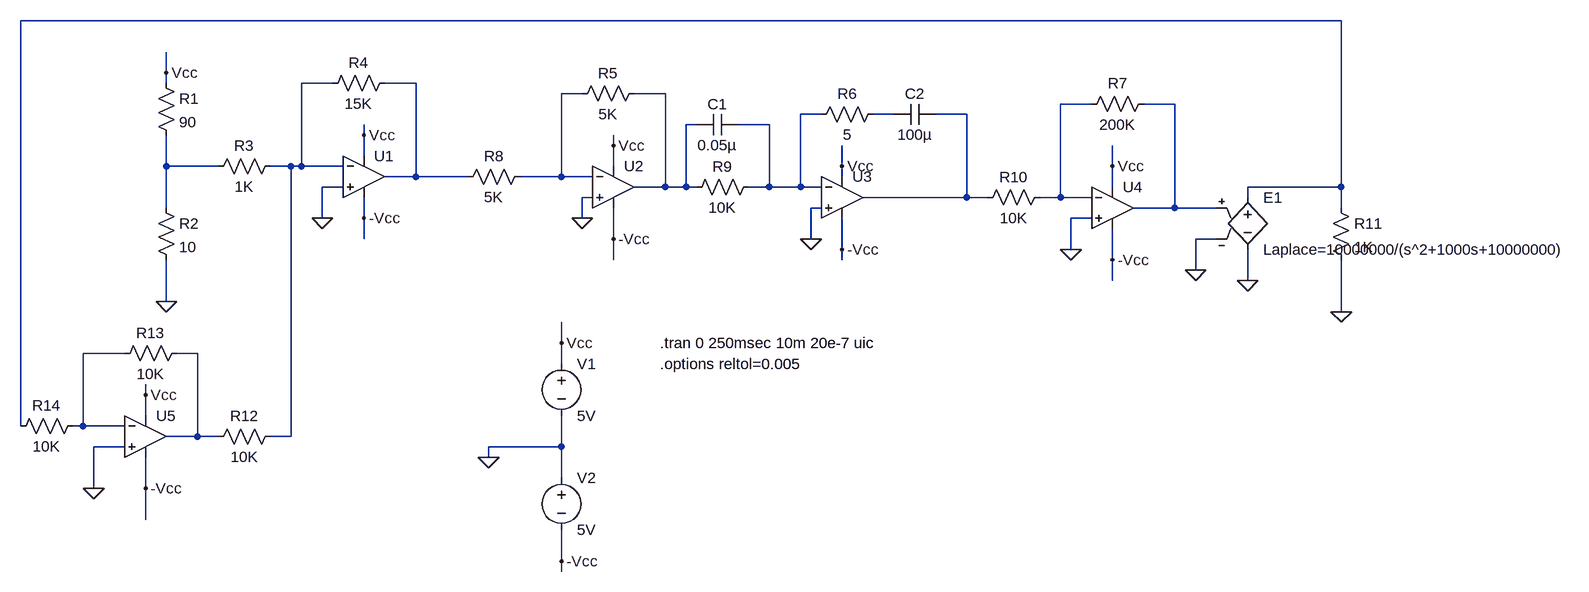
[diagram p0: schematic Practica_5.asc]
Practica_5.asc, the LTspice schematic file:
Version 4
SHEET 1 2892 772
WIRE 2480 -128 448 -128
WIRE 672 -48 672 -80
WIRE 672 -32 672 -48
WIRE 928 -32 880 -32
WIRE 1056 -32 1008 -32
WIRE 1312 -16 1280 -16
WIRE 1440 -16 1392 -16
WIRE 2096 0 2048 0
WIRE 2224 0 2176 0
WIRE 1680 16 1648 16
WIRE 1792 16 1760 16
WIRE 1904 16 1856 16
WIRE 1488 32 1472 32
WIRE 1600 32 1552 32
WIRE 976 48 976 32
WIRE 1360 64 1360 48
WIRE 976 80 976 48
WIRE 672 96 672 48
WIRE 752 96 672 96
WIRE 864 96 832 96
WIRE 880 96 880 -32
WIRE 880 96 864 96
WIRE 944 96 880 96
WIRE 1360 96 1360 64
WIRE 1712 96 1712 64
WIRE 2128 96 2128 64
WIRE 1056 112 1056 -32
WIRE 1056 112 1008 112
WIRE 1136 112 1056 112
WIRE 1280 112 1280 -16
WIRE 1280 112 1216 112
WIRE 1328 112 1280 112
WIRE 1712 112 1712 96
WIRE 944 128 912 128
WIRE 1440 128 1440 -16
WIRE 1440 128 1392 128
WIRE 1472 128 1472 32
WIRE 1472 128 1440 128
WIRE 1488 128 1472 128
WIRE 1600 128 1600 32
WIRE 1600 128 1568 128
WIRE 1648 128 1648 16
WIRE 1648 128 1600 128
WIRE 1680 128 1648 128
WIRE 2128 128 2128 96
WIRE 2480 128 2480 -128
WIRE 2480 128 2336 128
WIRE 1328 144 1312 144
WIRE 1904 144 1904 16
WIRE 1904 144 1744 144
WIRE 1936 144 1904 144
WIRE 2048 144 2048 0
WIRE 2048 144 2016 144
WIRE 2096 144 2048 144
WIRE 2336 144 2336 128
WIRE 672 160 672 96
WIRE 1680 160 1664 160
WIRE 2224 160 2224 0
WIRE 2224 160 2160 160
WIRE 2288 160 2224 160
WIRE 2480 160 2480 128
WIRE 912 176 912 128
WIRE 976 176 976 144
WIRE 1312 176 1312 144
WIRE 2096 176 2064 176
WIRE 976 208 976 176
WIRE 1360 208 1360 160
WIRE 1664 208 1664 160
WIRE 2288 208 2256 208
WIRE 1712 224 1712 176
WIRE 2064 224 2064 176
WIRE 1360 240 1360 208
WIRE 1712 240 1712 224
WIRE 2128 240 2128 192
WIRE 2256 256 2256 208
WIRE 2128 272 2128 240
WIRE 2336 272 2336 224
WIRE 672 304 672 240
WIRE 2480 320 2480 240
WIRE 1280 368 1280 336
WIRE 608 384 544 384
WIRE 720 384 688 384
WIRE 1280 400 1280 368
WIRE 640 448 640 432
WIRE 640 480 640 448
WIRE 448 496 448 -128
WIRE 544 496 544 384
WIRE 544 496 528 496
WIRE 608 496 544 496
WIRE 720 512 720 384
WIRE 720 512 672 512
WIRE 752 512 720 512
WIRE 864 512 864 96
WIRE 864 512 832 512
WIRE 608 528 560 528
WIRE 1280 528 1280 480
WIRE 1280 528 1168 528
WIRE 1168 544 1168 528
WIRE 1280 576 1280 528
WIRE 560 592 560 528
WIRE 640 592 640 544
WIRE 640 640 640 592
WIRE 1280 704 1280 656
WIRE 1280 720 1280 704
FLAG 1168 544 0
FLAG 1280 368 Vcc
FLAG 1280 704 -Vcc
FLAG 672 304 0
FLAG 672 -48 Vcc
FLAG 976 48 Vcc
FLAG 976 176 -Vcc
FLAG 1360 64 Vcc
FLAG 1360 208 -Vcc
FLAG 912 176 0
FLAG 1312 176 0
FLAG 1712 96 Vcc
FLAG 1712 224 -Vcc
FLAG 1664 208 0
FLAG 2128 96 Vcc
FLAG 2128 240 -Vcc
FLAG 640 448 Vcc
FLAG 640 592 -Vcc
FLAG 560 592 0
FLAG 2480 320 0
FLAG 2064 224 0
FLAG 2256 256 0
FLAG 2336 272 0
SYMBOL voltage 1280 384 R0
WINDOW 123 0 0 Left 0
WINDOW 39 0 0 Left 0
SYMATTR InstName V1
SYMATTR Value 5V
SYMBOL voltage 1280 560 R0
WINDOW 123 0 0 Left 0
WINDOW 39 0 0 Left 0
SYMATTR InstName V2
SYMATTR Value 5V
SYMBOL res 656 -48 R0
SYMATTR InstName R1
SYMATTR Value 90
SYMBOL res 656 144 R0
SYMATTR InstName R2
SYMATTR Value 10
SYMBOL res 848 80 R90
WINDOW 0 0 56 VBottom 2
WINDOW 3 32 56 VTop 2
SYMATTR InstName R3
SYMATTR Value 1K
SYMBOL res 1024 -48 R90
WINDOW 0 0 56 VBottom 2
WINDOW 3 32 56 VTop 2
SYMATTR InstName R4
SYMATTR Value 15K
SYMBOL res 1408 -32 R90
WINDOW 0 0 56 VBottom 2
WINDOW 3 32 56 VTop 2
SYMATTR InstName R5
SYMATTR Value 5K
SYMBOL res 2192 -16 R90
WINDOW 0 0 56 VBottom 2
WINDOW 3 32 56 VTop 2
SYMATTR InstName R7
SYMATTR Value 200K
SYMBOL res 1232 96 R90
WINDOW 0 0 56 VBottom 2
WINDOW 3 32 56 VTop 2
SYMATTR InstName R8
SYMATTR Value 5K
SYMBOL res 1584 112 R90
WINDOW 0 0 56 VBottom 2
WINDOW 3 32 56 VTop 2
SYMATTR InstName R9
SYMATTR Value 10K
SYMBOL cap 1552 16 R90
WINDOW 0 0 32 VBottom 2
WINDOW 3 32 32 VTop 2
SYMATTR InstName C1
SYMATTR Value 0.05µ
SYMBOL cap 1856 0 R90
WINDOW 0 0 32 VBottom 2
WINDOW 3 32 32 VTop 2
SYMATTR InstName C2
SYMATTR Value 100µ
SYMBOL res 2032 128 R90
WINDOW 0 0 56 VBottom 2
WINDOW 3 32 56 VTop 2
SYMATTR InstName R10
SYMATTR Value 10K
SYMBOL res 848 496 R90
WINDOW 0 0 56 VBottom 2
WINDOW 3 32 56 VTop 2
SYMATTR InstName R12
SYMATTR Value 10K
SYMBOL res 704 368 R90
WINDOW 0 0 56 VBottom 2
WINDOW 3 32 56 VTop 2
SYMATTR InstName R13
SYMATTR Value 10K
SYMBOL res 544 480 R90
WINDOW 0 0 56 VBottom 2
WINDOW 3 32 56 VTop 2
SYMATTR InstName R14
SYMATTR Value 10K
SYMBOL res 1776 0 R90
WINDOW 0 0 56 VBottom 2
WINDOW 3 32 56 VTop 2
SYMATTR InstName R6
SYMATTR Value 5
SYMBOL OpAmps\\UniversalOpAmp1 976 112 R0
SYMATTR InstName U1
SYMBOL OpAmps\\UniversalOpAmp1 1360 128 R0
SYMATTR InstName U2
SYMBOL OpAmps\\UniversalOpAmp1 1712 144 R0
SYMATTR InstName U3
SYMBOL OpAmps\\UniversalOpAmp1 2128 160 R0
SYMATTR InstName U4
SYMBOL OpAmps\\UniversalOpAmp1 640 512 R0
SYMATTR InstName U5
SYMBOL e 2336 128 R0
SYMATTR InstName E1
SYMATTR Value Laplace=10000000/(s^2+1000s+10000000)
SYMBOL res 2464 144 R0
SYMATTR InstName R11
SYMATTR Value 1K
TEXT 1432 368 Left 2 !.tran 0 250msec 10m 20e-7 uic
TEXT 1432 400 Left 2 !.options reltol=0.005

The netlist it stands for:
* Practica_5.asc
V1 Vcc 0 5V
V2 0 -Vcc 5V
R1 Vcc N011 90
R2 N011 0 10
R3 N002 N011 1K
R4 N003 N002 15K
R5 N005 N004 5K
R7 N007 N006 200K
R8 N004 N003 5K
R9 N008 N005 10K
C1 N008 N005 0.05µ
C2 N010 N009 100µ
R10 N006 N010 10K
R12 N002 N013 10K
R13 N013 N012 10K
R14 N012 N001 10K
R6 N009 N008 5
XU1 0 N002 Vcc -Vcc N003 level1 Avol=1Meg GBW=10Meg Vos=0 En=0 Enk=0 In=0 Ink=0 Rin=500Meg  ; pins In+ In- V+ V- OUT
XU2 0 N004 Vcc -Vcc N005 level1 Avol=1Meg GBW=10Meg Vos=0 En=0 Enk=0 In=0 Ink=0 Rin=500Meg  ; pins In+ In- V+ V- OUT
XU3 0 N008 Vcc -Vcc N010 level1 Avol=1Meg GBW=10Meg Vos=0 En=0 Enk=0 In=0 Ink=0 Rin=500Meg  ; pins In+ In- V+ V- OUT
XU4 0 N006 Vcc -Vcc N007 level1 Avol=1Meg GBW=10Meg Vos=0 En=0 Enk=0 In=0 Ink=0 Rin=500Meg  ; pins In+ In- V+ V- OUT
XU5 0 N012 Vcc -Vcc N013 level1 Avol=1Meg GBW=10Meg Vos=0 En=0 Enk=0 In=0 Ink=0 Rin=500Meg  ; pins In+ In- V+ V- OUT
E1 N001 0 N007 0 Laplace=10000000/(s^2+1000s+10000000)
R11 N001 0 1K
.tran 0 250msec 10m 20e-7 uic
.options reltol=0.005
.lib UniversalOpAmp1.lib
.backanno
.end